# EAGLE design Crossover (EAGLE 5.07)
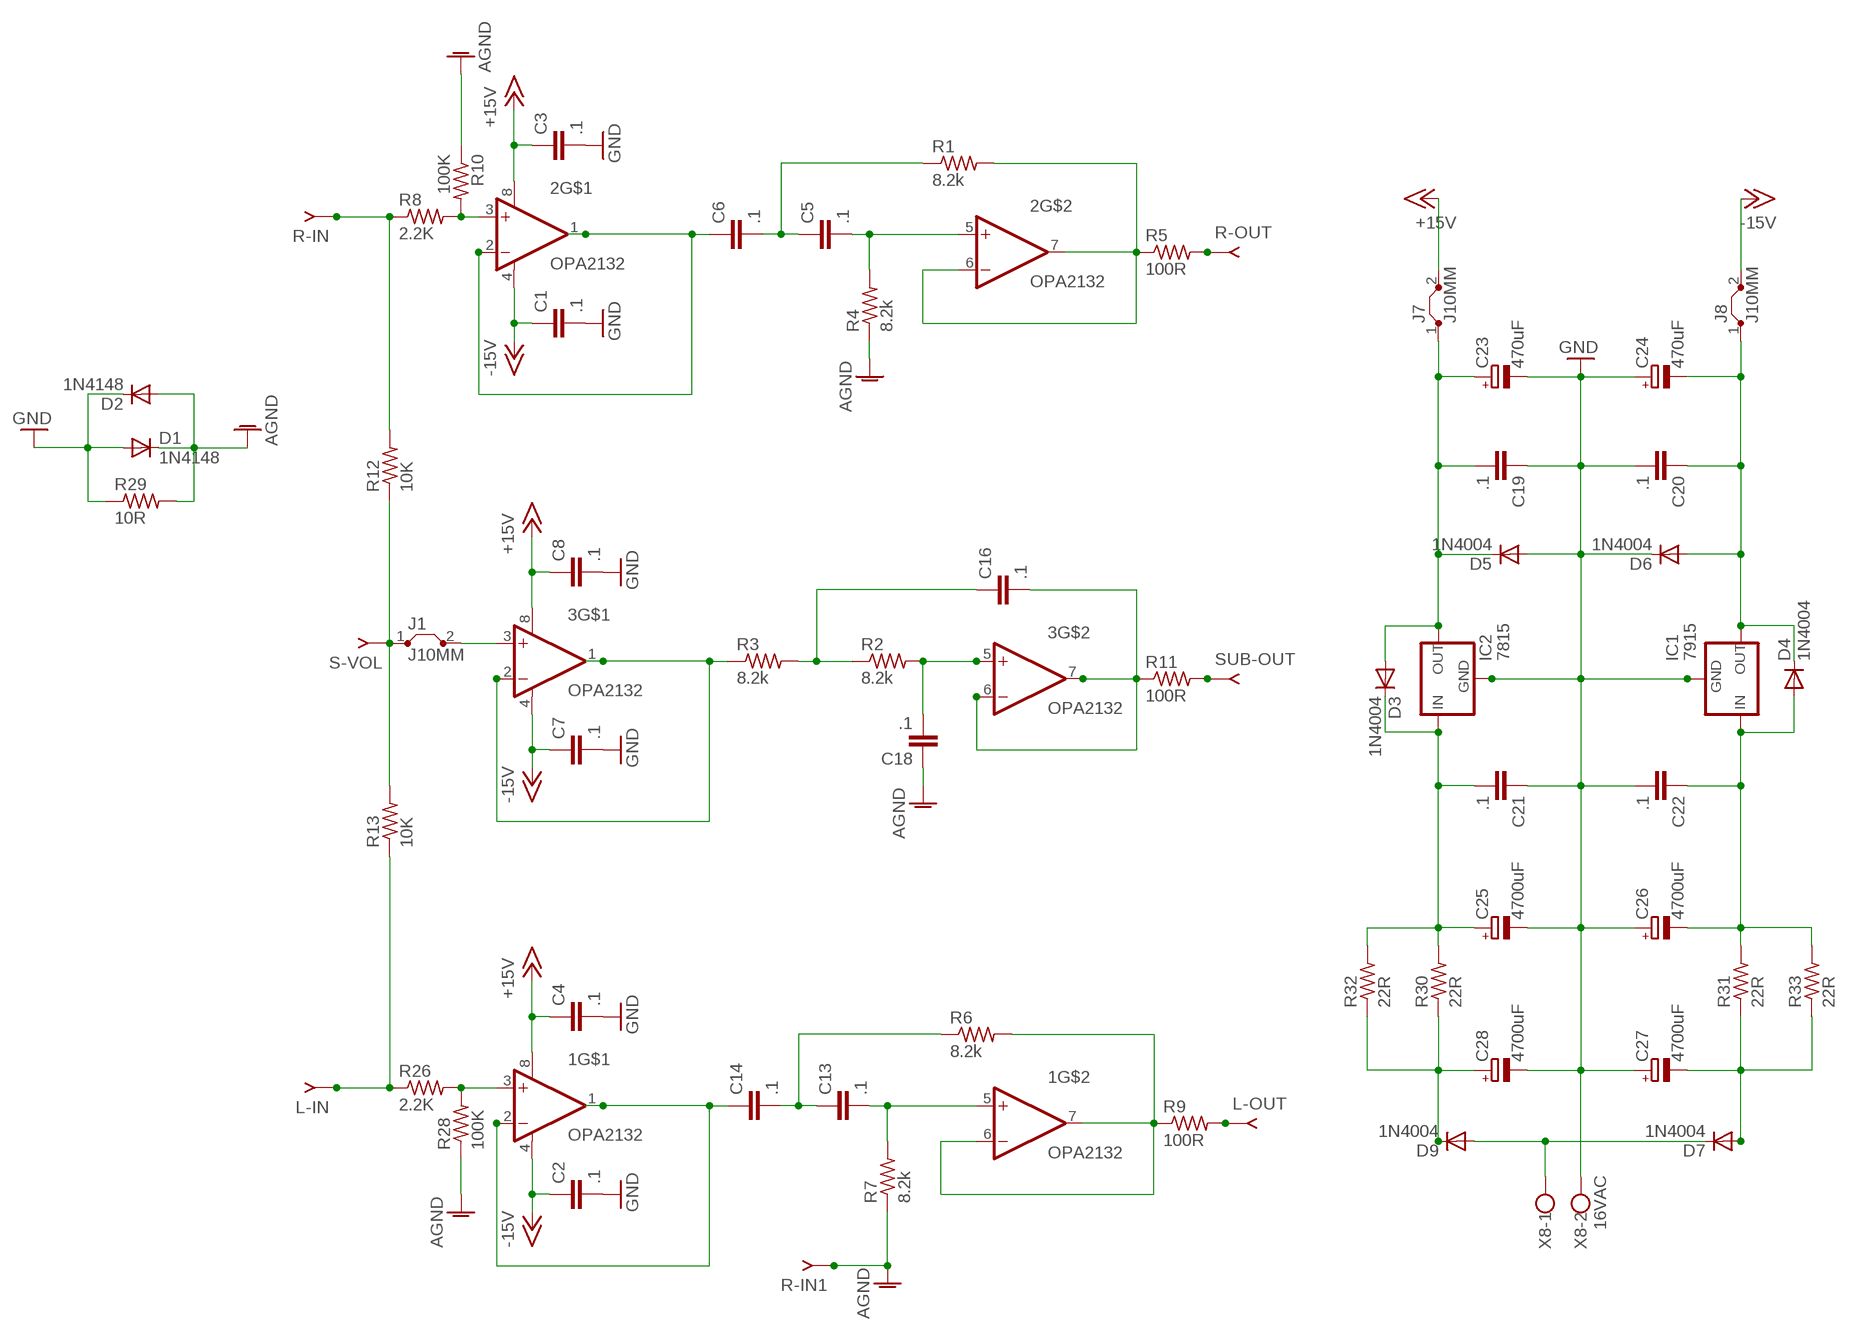
[diagram p0: schematic, sheet 1]

## Parts
1  OPA2132  DUAL-OPAMP  [DIP-8]
2  OPA2132  DUAL-OPAMP  [DIP-8]
3  OPA2132  DUAL-OPAMP  [DIP-8]
C1  .1  C-EU102-043X133  [C102-043X133]
C2  .1  C-EU102-043X133  [C102-043X133]
C3  .1  C-EU102-043X133  [C102-043X133]
C4  .1  C-EU102-043X133  [C102-043X133]
C5  .1  C-EU102-043X133  [C102-043X133]
C6  .1  C-EU102-043X133  [C102-043X133]
C7  .1  C-EU102-043X133  [C102-043X133]
C8  .1  C-EU102-043X133  [C102-043X133]
C13  .1  C-EU102-043X133  [C102-043X133]
C14  .1  C-EU102-043X133  [C102-043X133]
C16  .1  C-EU102-043X133  [C102-043X133]
C18  .1  C-EU102-043X133  [C102-043X133]
C19  .1  C-EU102-043X133  [C102-043X133]
C20  .1  C-EU102-043X133  [C102-043X133]
C21  .1  C-EU102-043X133  [C102-043X133]
C22  .1  C-EU102-043X133  [C102-043X133]
C23  470uF  CPOL-EUTT5D11  [TT5D11]
C24  470uF  CPOL-EUTT5D11  [TT5D11]
C25  4700uF  CPOL-EUE7.5-18  [E7,5-18]
C26  4700uF  CPOL-EUE7.5-18  [E7,5-18]
C27  4700uF  CPOL-EUE7.5-18  [E7,5-18]
C28  4700uF  CPOL-EUE7.5-18  [E7,5-18]
D1  1N4148  1N4148DO35-10  [DO35-10]
D2  1N4148  1N4148DO35-10  [DO35-10]
D3  1N4004  [DO41-10]
D4  1N4004  [DO41-10]
D5  1N4004  [DO41-10]
D6  1N4004  [DO41-10]
D7  1N4004  [DO41-10]
D9  1N4004  [DO41-10]
IC1  7915  79XXS  [79XXS]
IC2  7815  78XXS  [78XXS]
J1  J10MM  [10]
J7  J10MM  [10]
J8  J10MM  [10]
L-IN  QFIT  [FASTON]
L-OUT  QFIT  [FASTON]
R1  8.2k  R-US_0309/12  [0309/12]
R2  8.2k  R-US_0309/12  [0309/12]
R3  8.2k  R-US_0309/12  [0309/12]
R4  8.2k  R-US_0309/12  [0309/12]
R5  100R  R-US_0309/12  [0309/12]
R6  8.2k  R-US_0309/12  [0309/12]
R7  8.2k  R-US_0309/12  [0309/12]
R8  2.2K  R-US_0309/12  [0309/12]
R9  100R  R-US_0309/12  [0309/12]
R10  100K  R-US_0309/12  [0309/12]
R11  100R  R-US_0309/12  [0309/12]
R12  10K  R-US_0309/12  [0309/12]
R13  10K  R-US_0309/12  [0309/12]
R26  2.2K  R-US_0309/12  [0309/12]
R28  100K  R-US_0309/12  [0309/12]
R29  10R  R-US_0309/12  [0309/12]
R30  22R  R-US_0309/12  [0309/12]
R31  22R  R-US_0309/12  [0309/12]
R32  22R  R-US_0309/12  [0309/12]
R33  22R  R-US_0309/12  [0309/12]
R-IN  QFIT  [FASTON]
R-IN1  QFIT  [FASTON]
R-OUT  QFIT  [FASTON]
S-VOL  QFIT  [FASTON]
SUB-OUT  QFIT  [FASTON]
X8  16VAC  W237-02P  [W237-132]

## Nets
+15V: 1.8(V+) 2.8(V+) 3.8(V+) C3.1 C4.1 C8.1 J7.2
-15V: 1.4(V-) 2.4(V-) 3.4(V-) C1.1 C2.1 C7.1 J8.2
AGND: C18.1 D1.C D2.A R4.1 R7.1 R10.1 R28.1 R29.2 R-IN1.1 R-IN1.2
GND: C1.2 C2.2 C3.2 C4.2 C7.2 C8.2 C19.1 C20.2 C21.1 C22.2 C23.- C24.+ C25.- C26.+ C27.+ C28.- D1.A D2.C D5.A D6.C IC1.GND IC2.GND R29.1 X8.2
N$1: 1.1(OUT) 1.2(-IN) C14.1
N$2: 3.6(-IN) 3.7(OUT) C16.2 R11.1
N$3: 1.6(-IN) 1.7(OUT) R6.2 R9.1
N$4: 2.1(OUT) 2.2(-IN) C6.1
N$5: 2.6(-IN) 2.7(OUT) R1.2 R5.1
N$6: 2.5(+IN) C5.2 R4.2
N$7: 3.5(+IN) C18.2 R2.2
N$8: C5.1 C6.2 R1.1
N$9: R5.2 R-OUT.1 R-OUT.2
N$10: 2.3(+IN) R8.2 R10.2
N$11: R8.1 R12.2 R-IN.1 R-IN.2
N$12: 1.5(+IN) C13.2 R7.2
N$13: 3.1(OUT) 3.2(-IN) R3.1
N$14: C13.1 C14.2 R6.1
N$15: C16.1 R2.1 R3.2
N$16: R11.2 SUB-OUT.1 SUB-OUT.2
N$17: L-OUT.1 L-OUT.2 R9.2
N$18: 3.3(+IN) J1.2
N$19: J1.1 R12.1 R13.2 S-VOL.1 S-VOL.2
N$34: 1.3(+IN) R26.2 R28.2
N$36: L-IN.1 L-IN.2 R13.1 R26.1
N$37: C27.- D7.A R31.1 R33.1
N$38: C21.2 C25.+ D3.C IC2.IN R30.2 R32.2
N$39: C19.2 C23.+ D3.A D5.C IC2.OUT J7.1
N$41: C22.1 C26.- D4.A IC1.IN R31.2 R33.2
N$42: D7.C D9.A X8.1
N$44: C28.+ D9.C R30.1 R32.1
N$50: C20.1 C24.- D4.C D6.A IC1.OUT J8.1

## Library data of the parts
1-3 = opamps:DUAL-OPAMP: Generic 2-channel DIP-8 opamp
C1-C8 C13 C14 C16 C18-C22 = resistor:C-EU: CAPACITOR, European symbol
C23-C28 = resistor:CPOL-EU: POLARIZED CAPACITOR, European symbol
D1 D2 = diode:1N4148: DIODE high speed (Philips)
D3-D7 D9 = diode:1N4004: DIODE general purpose rectifier, 1 A
IC1 = v-reg:79XXS: VOLTAGE REGULATOR
IC2 = v-reg:78XXS: VOLTAGE REGULATOR
J1 J7 J8 = jumper:J: Bridge
L-IN L-OUT R-IN R-IN1 R-OUT S-VOL SUB-OUT = keystone:QFIT: QUICKFIT PCB TERMINAL
R1-R13 R26 R28-R33 = resistor:R-US_: RESISTOR, American symbol
X8 = con-wago-508:W237-02P: WAGO SREW CLAMP

## Board
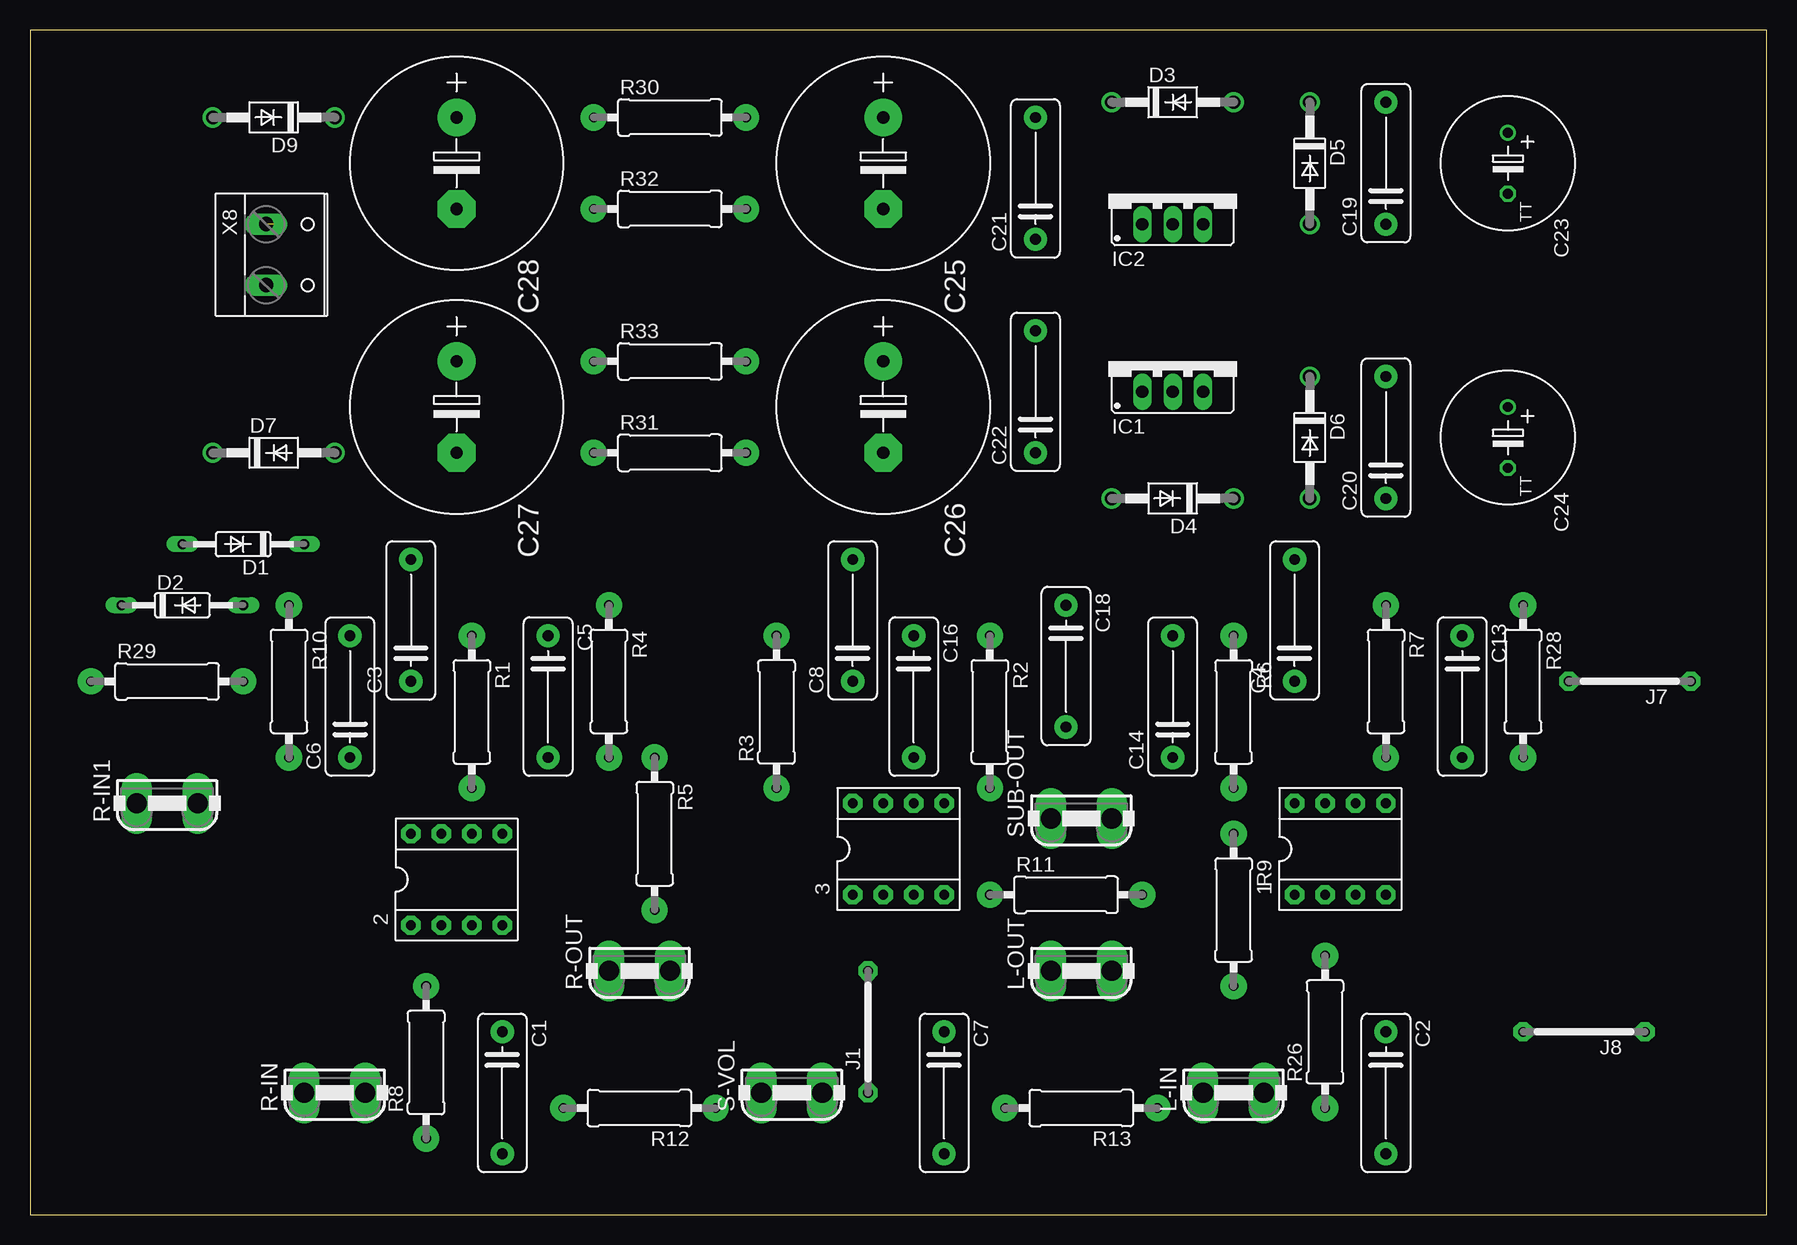
[diagram p1: board, top side]
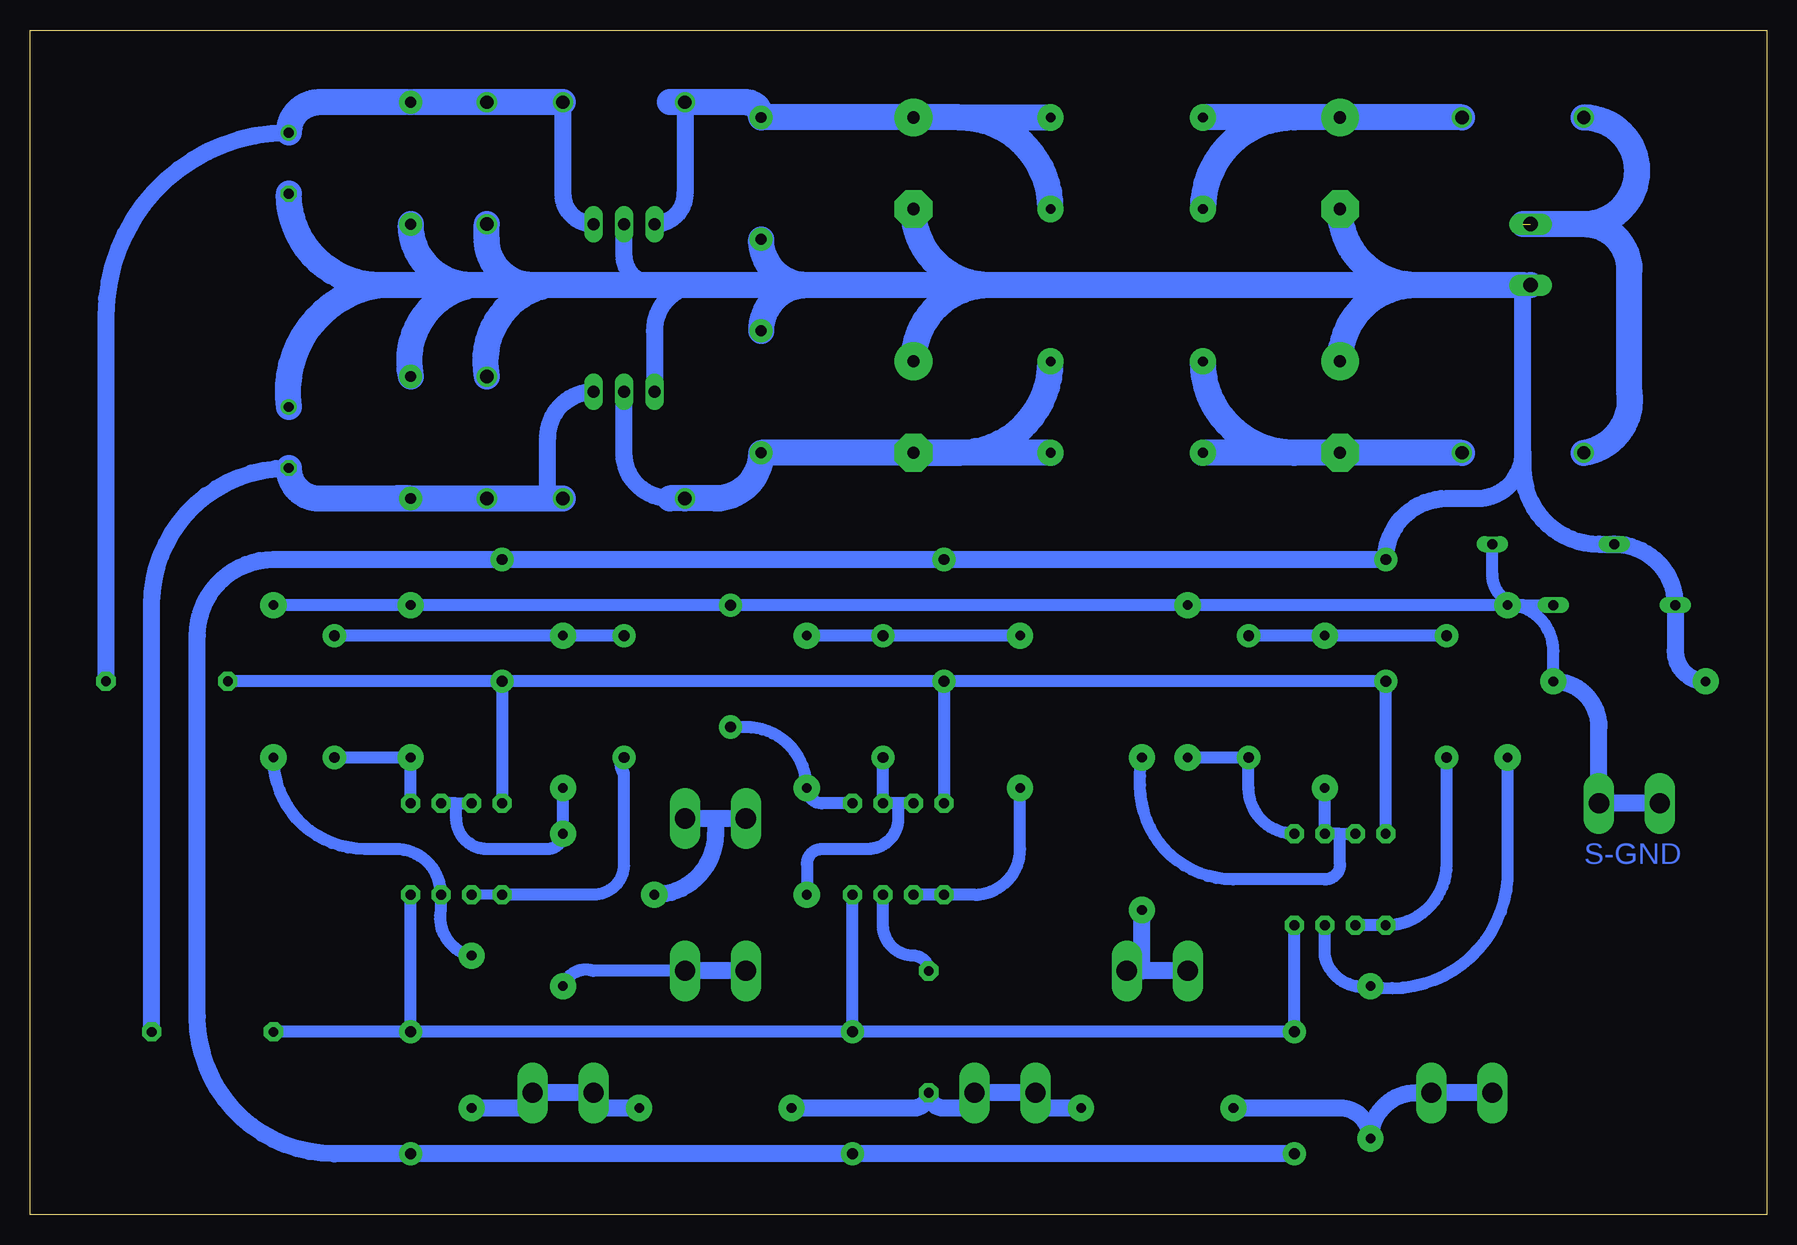
[diagram p2: board, bottom side, seen from below]

Size 144.76 x 98.73 mm. Coordinates in mm from the lower left corner, seen from the top.
Outline: 0,0 144.76,0 144.76,98.73 0,98.73 0,0
Copper layers (1*16): Top 0.035mm / dielectric 1.5mm / Bottom 0.035mm
Design rules "default": minimum track width 10mil, minimum drill 24mil, track to track 8mil, track to pad 8mil, pad to pad 8mil, via to via 8mil, smd to smd 8mil, copper to edge 40mil, drill to drill 8mil, minimum pad ring 10mil, minimum via ring 8mil, stop-mask expansion 4mil, vias tented up to drill 0mil, thermal gap 10mil

### Footprints (pad centres in the part's own frame; a part is rotated, then mirrored left to right if it is on the bottom)
DIP-8 = drill 0.813 pad 1.6 octagon: 1 -3.81,3.81; 2 -3.81,1.27; 3 -3.81,-1.27; 4 -3.81,-3.81; 5 3.81,-3.81; 6 3.81,-1.27; 7 3.81,1.27; 8 3.81,3.81
C102-043X133 = drill 0.9 pad 1.93: 1 -5.08,0; 2 5.08,0
TT5D11 = drill 0.813: + -2.54,0 | drill 0.813 octagon: - 2.54,0
E7,5-18 = drill 1.016 pad 3.15: + -3.81,0 | drill 1.016 pad 3.15 octagon: - 3.81,0
DO35-10 = drill 0.813 long: A 5.08,0; C -5.08,0
DO41-10 = drill 1.118: A 5.08,0; C -5.08,0
79XXS = drill 1.016 long: GND -2.54,-2.54; IN 0,-2.54; OUT 2.54,-2.54
78XXS = drill 1.016 long: GND 0,-2.54; IN -2.54,-2.54; OUT 2.54,-2.54
10 = drill 0.813 pad 1.6 octagon: 1 -5.08,0; 2 5.08,0
FASTON = drill 1.676 pad 2.54 long: 1 -2.54,0; 2 2.54,0
0309/12 = drill 0.8 pad 2.184: 1 -6.35,0; 2 6.35,0
W237-132 = drill 1.194 long: 1 -2.54,-0.635; 2 2.54,-0.635

### Placement (x,y rotation side)
1  109.22,30.48 90 top
2  35.56,27.94 90 top
3  72.39,30.48 90 top
C1  39.37,10.16 270 top
C2  113.03,10.16 270 top
C3  31.75,49.53 90 top
C4  105.41,49.53 90 top
C5  43.18,43.18 270 top
C6  26.67,43.18 90 top
C7  76.2,10.16 270 top
C8  68.58,49.53 90 top
C13  119.38,43.18 270 top
C14  95.25,43.18 90 top
C16  73.66,43.18 270 top
C18  86.36,45.72 270 top
C19  113.03,87.63 90 top
C20  113.03,64.77 90 top
C21  83.82,86.36 90 top
C22  83.82,68.58 90 top
C23  123.19,87.63 270 top
C24  123.19,64.77 270 top
C25  71.12,87.63 270 top
C26  71.12,67.31 270 top
C27  35.56,67.31 270 top
C28  35.56,87.63 270 top
D1  17.78,55.88 180 top
D2  12.7,50.8 0 top
D3  95.25,92.71 0 top
D4  95.25,59.69 180 top
D5  106.68,87.63 270 top
D6  106.68,64.77 270 top
D7  20.32,63.5 0 top
D9  20.32,91.44 180 top
IC1  95.25,71.12 0 top
IC2  95.25,85.09 0 top
J1  69.85,15.24 90 top
J7  133.35,44.45 180 top
J8  129.54,15.24 180 top
L-IN  100.33,10.16 0 top
L-OUT  87.63,20.32 0 top
R1  36.83,41.91 270 top
R2  80.01,41.91 270 top
R3  62.23,41.91 90 top
R4  48.26,44.45 270 top
R5  52.07,31.75 270 top
R6  100.33,41.91 270 top
R7  113.03,44.45 270 top
R8  33.02,12.7 90 top
R9  100.33,25.4 270 top
R10  21.59,44.45 270 top
R11  86.36,26.67 0 top
R12  50.8,8.89 180 top
R13  87.63,8.89 180 top
R26  107.95,15.24 90 top
R28  124.46,44.45 270 top
R29  11.43,44.45 0 top
R30  53.34,91.44 0 top
R31  53.34,63.5 0 top
R32  53.34,83.82 0 top
R33  53.34,71.12 0 top
R-IN  25.4,10.16 0 top
R-IN1  11.43,34.29 0 top
R-OUT  50.8,20.32 0 top
S-VOL  63.5,10.16 0 top
SUB-OUT  87.63,33.02 0 top
X8  20.32,80.01 270 top

### Tracks (layer width: path | path; a pad name or v marks a point on that pad's centre or on a via)
+15V
  Bottom 1.016: C4.1 1.8 | C8.1 3.8 | 2.8 C3.1 C8.1 | C8.1 C4.1 | C4.1 J7.2
-15V
  Bottom 1.016: C2.1 1.4 | 2.4 C1.1 C7.1 | C7.1 3.4 | C7.1 C2.1 | C2.1 J8.2
AGND
  Bottom 1.016: R28.1 R7.1 C18.1 R4.1 R10.1 | 20.32,50.8 D2.A | R10.1 20.32,50.8 | D1.C 22.86,53.34 arc-90 20.32,50.8 | R29.2 17.78,46.99 arc-90 R10.1
  Bottom 1.422: R-IN1.1 R-IN1.2 13.97,40.64 arc-90 R29.2
GND
  Bottom 1.422: IC1.GND 92.71,73.66 arc90 88.9,77.47 | IC2.GND 95.25,80.01 arc-90 92.71,77.47 | C1.2 C7.2 C2.2 119.38,5.08 arc90 130.81,16.51 130.81,48.26 arc90 124.46,54.61 C4.2 C8.2 C3.2 arc90 26.67,59.69 24.13,59.69 arc-90 20.32,63.5 | X8.2 19.05,77.47 | R29.1 arc90 7.62,46.99 D2.C arc-90 D1.A 13.97,55.88 arc90 20.32,62.23 20.32,63.5 | 20.32,63.5 20.32,77.47
  Bottom 2.184: 64.77,77.47 arc90 C25.- | 29.21,77.47 arc90 C28.- | 29.21,77.47 arc-90 C27.+ | X8.2 20.32,77.47 29.21,77.47 | 64.77,77.47 arc-90 C26.+ | 29.21,77.47 64.77,77.47 | 80.01,77.47 arc90 C21.1 | 80.01,77.47 arc-90 C22.2 | 64.77,77.47 80.01,77.47 | 107.95,77.47 arc-90 C20.2 | 107.95,77.47 arc90 C19.1 | 101.6,77.47 102.87,77.47 | 102.87,77.47 107.95,77.47 | 101.6,77.47 arc-90 D6.C | 80.01,77.47 88.9,77.47 92.71,77.47 101.6,77.47 | D5.A 106.68,81.28 arc-90 102.87,77.47 | 115.57,77.47 arc90 C23.- | 115.57,77.47 arc-90 C24.+ | 107.95,77.47 115.57,77.47
N$1
  Bottom 0.813: 1.1 1.2
  Bottom 1.016: 1.1 97.79,26.67 arc-90 95.25,29.21 95.25,36.83 arc90 C14.1
N$2
  Bottom 1.016: C16.2 3.6 72.39,34.29 | 3.7 72.39,34.29 | R11.1 80.01,29.21 arc90 78.74,30.48 74.93,30.48 arc-90 72.39,33.02 72.39,34.29
N$3
  Bottom 1.016: 109.22,34.29 1.7 | 109.22,34.29 1.6 | R6.2 R9.1 arc90 101.6,30.48 106.68,30.48 arc90 109.22,33.02 109.22,34.29
N$4
  Bottom 1.016: 2.2 2.1 arc-90 26.67,29.21 C6.1
N$5
  Bottom 1.016: 35.56,31.75 2.7 | 35.56,31.75 2.6 R1.2 | 35.56,31.75 35.56,29.21 arc90 36.83,27.94 44.45,27.94 arc80 52.07,34.29 arc21 R5.1
N$6
  Bottom 1.016: 2.5 arc90 43.18,35.56 C5.2 R4.2
N$7
  Bottom 1.016: 3.5 78.74,34.29 arc90 R2.2 arc-90 85.09,40.64 C18.2
N$8
  Bottom 1.016: C6.2 R1.1 C5.1
N$9
  Bottom 1.422: R5.2 52.07,20.32 R-OUT.2 R-OUT.1
N$10
  Bottom 1.016: 2.3 36.83,21.59 arc-90 R8.2 arc-97 21.59,27.94 R10.2
N$11
  Bottom 1.422: R-IN.1 R-IN.2 29.21,10.16 arc-90 R8.1 arc-90 35.56,8.89 R12.2
N$12
  Bottom 1.016: C13.2 R7.2 1.5
N$13
  Bottom 1.016: 3.2 3.1 66.04,26.67 arc-90 62.23,30.48 R3.1
N$14
  Bottom 1.016: C14.2 R6.1 C13.1
N$15
  Bottom 1.016: R3.2 C16.1 R2.1
N$16
  Bottom 1.422: SUB-OUT.1 87.63,33.02 | 87.63,33.02 SUB-OUT.2 | 87.63,33.02 87.63,31.75 arc90 R11.2
N$17
  Bottom 1.016: L-OUT.2 97.79,20.32 arc-90 R9.2
  Bottom 1.422: L-OUT.1 L-OUT.2
N$18
  Bottom 1.016: 3.3 73.66,24.13 arc-90 71.12,21.59 arc90 J1.2
N$19
  Bottom 1.422: R12.1 59.69,8.89 arc90 S-VOL.1 S-VOL.2 arc90 67.31,8.89 68.58,8.89 arc90 J1.1 arc90 71.12,8.89 R13.2
N$34
  Bottom 1.016: R26.2 arc90 110.49,25.4 1.3 arc-90 114.3,30.48 116.84,30.48 arc90 R28.2
N$36
  Bottom 1.422: R13.1 96.52,8.89 arc90 L-IN.1 L-IN.2 arc90 104.14,8.89 R26.1
N$37
  Bottom 2.184: C27.- 39.37,63.5 arc90 R33.1 | C27.- R31.1 | D7.A C27.-
N$38
  Bottom 1.422: D3.C 90.17,85.09 arc90 IC2.IN
  Bottom 2.184: 67.31,91.44 C25.+ C21.2 arc-90 85.09,92.71 D3.C 91.44,92.71 | R32.2 arc-90 67.31,91.44 | 67.31,91.44 R30.2
N$39
  Bottom 1.422: D3.A 100.33,85.09 arc-90 IC2.OUT | J7.1 138.43,74.93 arc90 C23.+
  Bottom 2.184: D3.A D5.C C19.2 120.65,92.71 arc-90 C23.+
N$41
  Bottom 1.422: 91.44,59.69 arc90 95.25,63.5 IC1.IN
  Bottom 2.184: C26.- 67.31,63.5 arc-90 R33.2 | R31.2 C26.- | C26.- C22.1 arc90 87.63,59.69 D4.A 91.44,59.69
N$42  (1 unrouted)
  Bottom 2.184: D7.C arc-90 11.43,68.58 11.43,78.74 arc-90 15.24,82.55 | 15.24,82.55 20.32,82.55 | 15.24,82.55 arc-180 D9.A
N$44
  Bottom 2.184: D9.C C28.+ 39.37,91.44 | 39.37,91.44 arc-90 R32.1 | 39.37,91.44 R30.1
N$50
  Bottom 1.422: IC1.OUT arc-90 101.6,64.77 101.6,59.69 | J8.1 134.62,50.8 arc90 C24.-
  Bottom 2.184: D4.C 101.6,59.69 D6.A C20.1 | C20.1 114.3,59.69 | C20.1 120.65,59.69 arc90 C24.-

### Text on the board
Bottom: S-GND